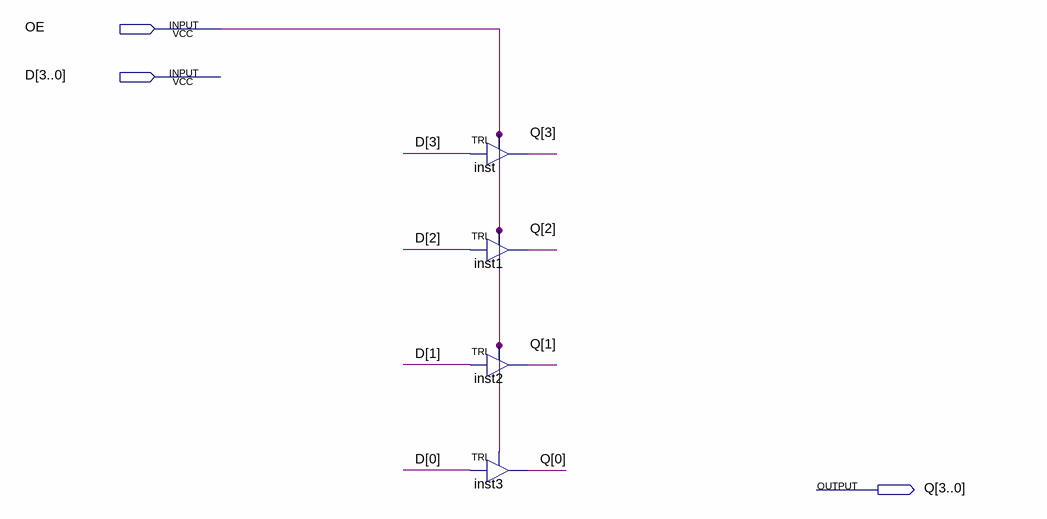
[diagram p0: schematic sheet]
// Quartus schematic TRI4Bits.bdf as structural Verilog: 4 symbols, 3 pins
module TRI4Bits (
  input  OE,
  input  [3:0] D,
  output [3:0] Q
);

  TRI inst (.IN(D[3]), .OE(OE), .OUT(Q[3]));
  TRI inst1 (.IN(D[2]), .OE(OE), .OUT(Q[2]));
  TRI inst2 (.IN(D[1]), .OE(OE), .OUT(Q[1]));
  TRI inst3 (.IN(D[0]), .OE(OE), .OUT(Q[0]));
endmodule
